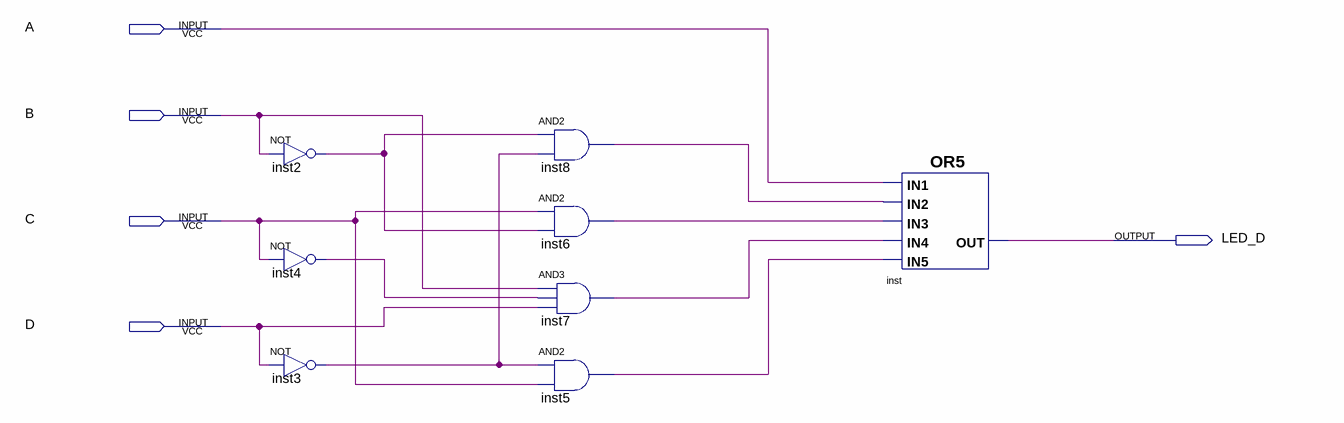
[diagram p0: schematic sheet]
// Quartus schematic led_d.bdf as structural Verilog: 8 symbols, 5 pins
module led_d (
  input  A,
  input  B,
  input  C,
  input  D,
  output LED_D
);

  wire inst2_out, inst3_out, inst4_out, inst5_out, inst6_out, inst7_out, inst8_out;

  not inst2 (inst2_out, B);
  not inst4 (inst4_out, C);
  not inst3 (inst3_out, D);
  and inst8 (inst8_out, inst2_out, inst3_out);
  and inst6 (inst6_out, C, inst2_out);
  and inst7 (inst7_out, B, inst4_out, D);
  and inst5 (inst5_out, inst3_out, C);
  or inst (LED_D, A, inst8_out, inst6_out, inst7_out, inst5_out);
endmodule
